# Altium project PCB_Project1.PrjPCB
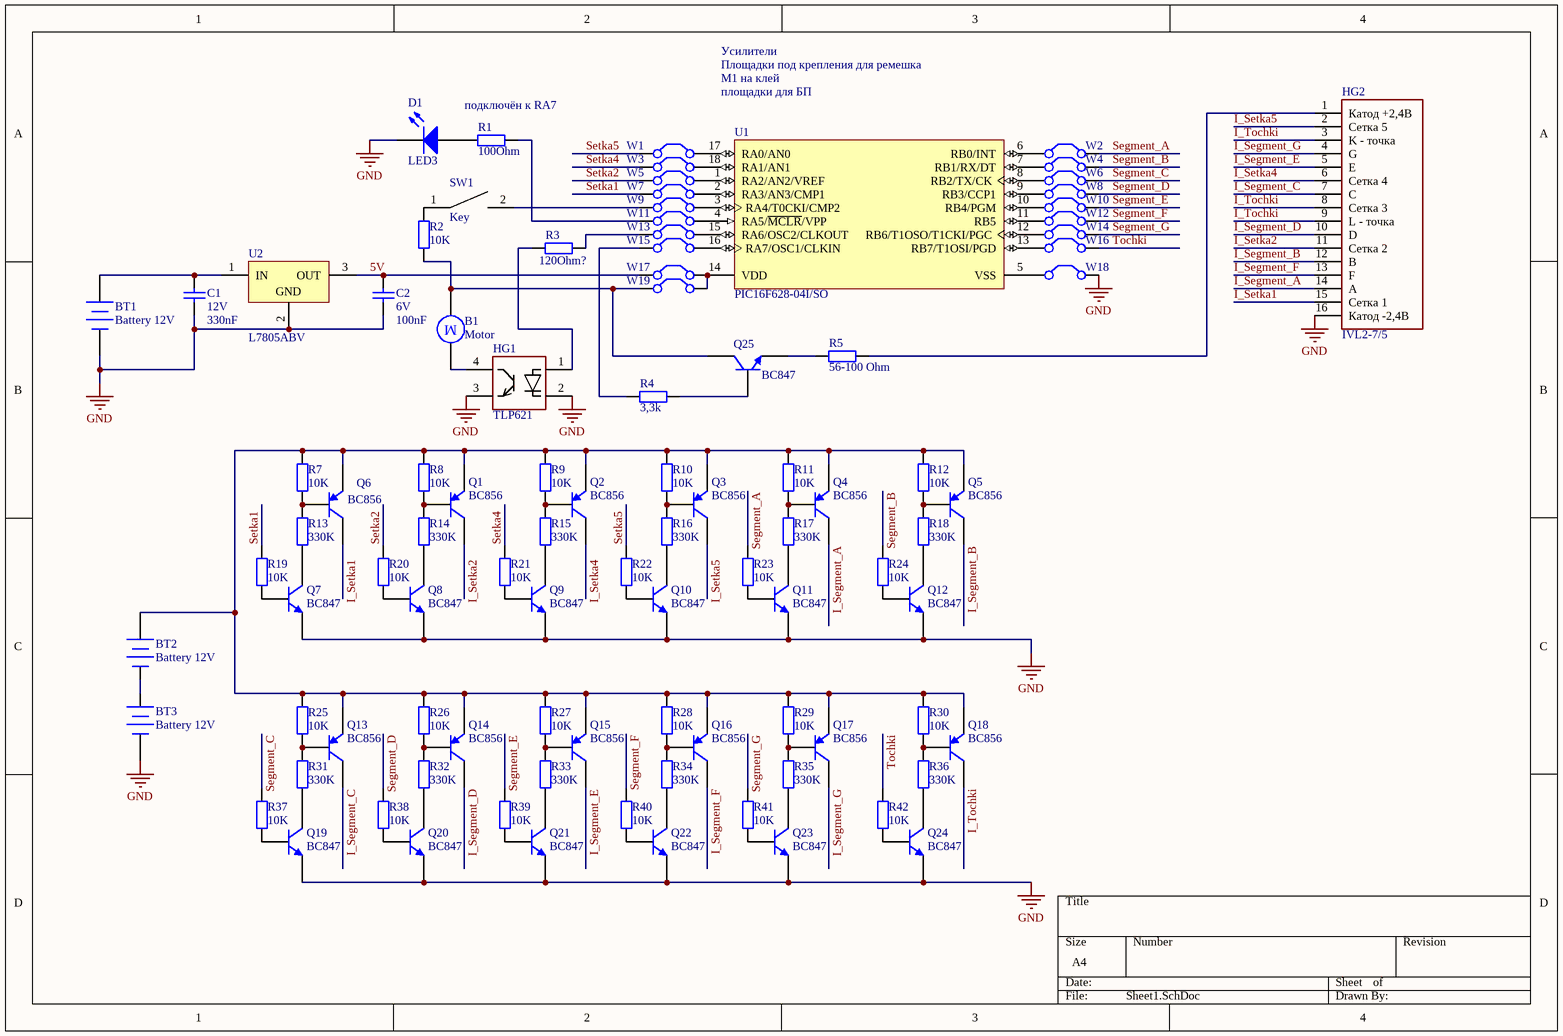
[diagram p0: Sheet1.SchDoc]
1 sheet, 97 parts. Net scope: global (net labels, ports and power ports of the same name join across sheets).
Board file: PCB1.PcbDoc

## Sheet Sheet1.SchDoc
size A4

### Parts
B1  Motor  [Motor]
BT1  Battery 12V  [BatteryA23]
BT2  Battery 12V  [BatteryA23]
BT3  Battery 12V  [BatteryA23]
C1  12V  value 330nF  [F1206]
C2  6V  value 100nF  [F1206]
D1  LED3  [F1206]
HG1  TLP621  [Photocoupler]
HG2  IVL2-7/5  [-IVL2-7/5]
Q1  BC856  [SOT23_L]
Q2  BC856  [SOT23_L]
Q3  BC856  [SOT23_L]
Q4  BC856  [SOT23_L]
Q5  BC856  [SOT23_L]
Q6  BC856  [SOT23_L]
Q7  BC847  [SOT23_N]
Q8  BC847  [SOT23_N]
Q9  BC847  [SOT23_N]
Q10  BC847  [SOT23_N]
Q11  BC847  [SOT23_N]
Q12  BC847  [SOT23_N]
Q13  BC856  [SOT23_L]
Q14  BC856  [SOT23_L]
Q15  BC856  [SOT23_L]
Q16  BC856  [SOT23_L]
Q17  BC856  [SOT23_L]
Q18  BC856  [SOT23_L]
Q19  BC847  [SOT23_N]
Q20  BC847  [SOT23_N]
Q21  BC847  [SOT23_N]
Q22  BC847  [SOT23_N]
Q23  BC847  [SOT23_N]
Q24  BC847  [SOT23_N]
Q25  BC847  [SOT23_N]
R1  value 100Ohm  [F1206]  (hidden comment: Res2)
R2  value 10K  [F1206]  (hidden comment: Res2)
R3  value 120Ohm?  [F1206]  (hidden comment: Res2)
R4  value 3,3k  [F1206]  (hidden comment: Res2)
R5  value 56-100 Ohm  [F1206]  (hidden comment: Res2)
R7  value 10K  [F0805]  (hidden comment: Res2)
R8  value 10K  [F0805]  (hidden comment: Res2)
R9  value 10K  [F0805]  (hidden comment: Res2)
R10  value 10K  [F0805]  (hidden comment: Res2)
R11  value 10K  [F0805]  (hidden comment: Res2)
R12  value 10K  [F0805]  (hidden comment: Res2)
R13  value 330K  [F1206]  (hidden comment: Res2)
R14  value 330K  [F1206]  (hidden comment: Res2)
R15  value 330K  [F1206]  (hidden comment: Res2)
R16  value 330K  [F1206]  (hidden comment: Res2)
R17  value 330K  [F1206]  (hidden comment: Res2)
R18  value 330K  [F1206]  (hidden comment: Res2)
R19  value 10K  [F1206]  (hidden comment: Res2)
R20  value 10K  [F1206]  (hidden comment: Res2)
R21  value 10K  [F1206]  (hidden comment: Res2)
R22  value 10K  [F1206]  (hidden comment: Res2)
R23  value 10K  [F1206]  (hidden comment: Res2)
R24  value 10K  [F1206]  (hidden comment: Res2)
R25  value 10K  [F0805]  (hidden comment: Res2)
R26  value 10K  [F0805]  (hidden comment: Res2)
R27  value 10K  [F0805]  (hidden comment: Res2)
R28  value 10K  [F0805]  (hidden comment: Res2)
R29  value 10K  [F0805]  (hidden comment: Res2)
R30  value 10K  [F0805]  (hidden comment: Res2)
R31  value 330K  [F1206]  (hidden comment: Res2)
R32  value 330K  [F1206]  (hidden comment: Res2)
R33  value 330K  [F1206]  (hidden comment: Res2)
R34  value 330K  [F1206]  (hidden comment: Res2)
R35  value 330K  [F1206]  (hidden comment: Res2)
R36  value 330K  [F1206]  (hidden comment: Res2)
R37  value 10K  [F1206]  (hidden comment: Res2)
R38  value 10K  [F1206]  (hidden comment: Res2)
R39  value 10K  [F1206]  (hidden comment: Res2)
R40  value 10K  [F1206]  (hidden comment: Res2)
R41  value 10K  [F1206]  (hidden comment: Res2)
R42  value 10K  [F1206]  (hidden comment: Res2)
SW1  Key  [Button]
U1  PIC16F628-04I/SO  [MCHP-SOIC-SO18_N]
U2  L7805ABV  [KREN]
W1  Jumper  [перемычка]  (value not drawn)
W2  Jumper  [перемычка]  (value not drawn)
W3  Jumper  [перемычка]  (value not drawn)
W4  Jumper  [перемычка]  (value not drawn)
W5  Jumper  [перемычка]  (value not drawn)
W6  Jumper  [перемычка]  (value not drawn)
W7  Jumper  [перемычка]  (value not drawn)
W8  Jumper  [перемычка]  (value not drawn)
W9  Jumper  [перемычка]  (value not drawn)
W10  Jumper  [перемычка]  (value not drawn)
W11  Jumper  [перемычка]  (value not drawn)
W12  Jumper  [перемычка]  (value not drawn)
W13  Jumper  [перемычка]  (value not drawn)
W14  Jumper  [перемычка]  (value not drawn)
W15  Jumper  [перемычка]  (value not drawn)
W16  Jumper  [перемычка]  (value not drawn)
W17  Jumper  [перемычка]  (value not drawn)
W18  Jumper  [перемычка]  (value not drawn)
W19  Jumper  [перемычка]  (value not drawn)

### Nets
GND: BT1.2(-) BT3.2(-) C1.1 C2.2 D1.2(K) HG1.2 HG1.3 HG2.16(Катод_-2,4В) Q7.2(E) Q8.2(E) Q9.2(E) Q10.2(E) Q11.2(E) Q12.2(E) Q19.2(E) Q20.2(E) Q21.2(E) Q22.2(E) Q23.2(E) Q24.2(E) U2.2(GND) W18.2(C2)
5V: C2.1 U2.3(OUT) W17.1(C1)
I_Segment_A: HG2.14(A) Q4.3(C)
I_Segment_B: HG2.12(B) Q5.3(C)
I_Segment_C: HG2.7(C) Q13.3(C)
I_Segment_D: HG2.10(D) Q14.3(C)
I_Segment_E: HG2.5(E) Q15.3(C)
I_Segment_F: HG2.13(F) Q16.3(C)
I_Segment_G: HG2.4(G) Q17.3(C)
I_Setka1: HG2.15(Сетка_1) Q6.3(C)
I_Setka2: HG2.11(Сетка_2) Q1.3(C)
I_Setka4: HG2.6(Сетка_4) Q2.3(C)
I_Setka5: HG2.2(Сетка_5) Q3.3(C)
I_Tochki: HG2.3(K_-_точка) HG2.8(Сетка_3) HG2.9(L_-_точка) Q18.3(C)
Segment_A: R23.1 W2.2(C2)
Segment_B: R24.1 W4.2(C2)
Segment_C: R37.1 W6.2(C2)
Segment_D: R38.1 W8.2(C2)
Segment_E: R39.1 W10.2(C2)
Segment_F: R40.1 W12.2(C2)
Segment_G: R41.1 W14.2(C2)
Setka1: R19.1 W7.1(C1)
Setka2: R20.1 W5.1(C1)
Setka4: R21.1 W3.1(C1)
Setka5: R22.1 W1.1(C1)
Tochki: R42.1 W16.2(C2)
NetB1_1: B1.1 HG1.4
NetB1_2: B1.2 Q25.3(C) R2.1 W19.1(C1)
NetBT1_1: BT1.1(+) C1.2 U2.1(IN)
NetBT2_1: BT2.1(+) Q1.2(E) Q2.2(E) Q3.2(E) Q4.2(E) Q5.2(E) Q6.2(E) Q13.2(E) Q14.2(E) Q15.2(E) Q16.2(E) Q17.2(E) Q18.2(E) R7.2 R8.2 R9.2 R10.2 R11.2 R12.2 R25.2 R26.2 R27.2 R28.2 R29.2 R30.2
NetBT2_2: BT2.2(-) BT3.1(+)
NetD1_1: D1.1(A) R1.1
NetHG1_1: HG1.1 R3.1
NetHG2_1: HG2.1(Катод_+2,4В) R5.1
NetQ1_1: Q1.1(B) R8.1 R14.2
NetQ2_1: Q2.1(B) R9.1 R15.2
NetQ3_1: Q3.1(B) R10.1 R16.2
NetQ4_1: Q4.1(B) R11.1 R17.2
NetQ5_1: Q5.1(B) R12.1 R18.2
NetQ6_1: Q6.1(B) R7.1 R13.2
NetQ7_1: Q7.1(B) R19.2
NetQ7_3: Q7.3(C) R13.1
NetQ8_1: Q8.1(B) R20.2
NetQ8_3: Q8.3(C) R14.1
NetQ9_1: Q9.1(B) R21.2
NetQ9_3: Q9.3(C) R15.1
NetQ10_1: Q10.1(B) R22.2
NetQ10_3: Q10.3(C) R16.1
NetQ11_1: Q11.1(B) R23.2
NetQ11_3: Q11.3(C) R17.1
NetQ12_1: Q12.1(B) R24.2
NetQ12_3: Q12.3(C) R18.1
NetQ13_1: Q13.1(B) R25.1 R31.2
NetQ14_1: Q14.1(B) R26.1 R32.2
NetQ15_1: Q15.1(B) R27.1 R33.2
NetQ16_1: Q16.1(B) R28.1 R34.2
NetQ17_1: Q17.1(B) R29.1 R35.2
NetQ18_1: Q18.1(B) R30.1 R36.2
NetQ19_1: Q19.1(B) R37.2
NetQ19_3: Q19.3(C) R31.1
NetQ20_1: Q20.1(B) R38.2
NetQ20_3: Q20.3(C) R32.1
NetQ21_1: Q21.1(B) R39.2
NetQ21_3: Q21.3(C) R33.1
NetQ22_1: Q22.1(B) R40.2
NetQ22_3: Q22.3(C) R34.1
NetQ23_1: Q23.1(B) R41.2
NetQ23_3: Q23.3(C) R35.1
NetQ24_1: Q24.1(B) R42.2
NetQ24_3: Q24.3(C) R36.1
NetQ25_1: Q25.1(B) R4.2
NetQ25_2: Q25.2(E) R5.2
NetR1_2: R1.2 W11.1(C1)
NetR2_2: R2.2 SW1.1
NetR3_2: R3.2 W13.1(C1)
NetR4_1: R4.1 W15.1(C1)
NetSW1_2: SW1.2 W9.1(C1)
NetU1_1: U1.1(RA2/AN2/VREF) W5.2(C2)
NetU1_2: U1.2(RA3/AN3/CMP1) W7.2(C2)
NetU1_3: U1.3(RA4/T0CKI/CMP2) W9.2(C2)
NetU1_4: U1.4(RA5/~{MCLR}/VPP) W11.2(C2)
NetU1_5: U1.5(VSS) W18.1(C1)
NetU1_6: U1.6(RB0/INT) W2.1(C1)
NetU1_7: U1.7(RB1/RX/DT) W4.1(C1)
NetU1_8: U1.8(RB2/TX/CK) W6.1(C1)
NetU1_9: U1.9(RB3/CCP1) W8.1(C1)
NetU1_10: U1.10(RB4/PGM) W10.1(C1)
NetU1_11: U1.11(RB5) W12.1(C1)
NetU1_12: U1.12(RB6/T1OSO/T1CKI/PGC) W14.1(C1)
NetU1_13: U1.13(RB7/T1OSI/PGD) W16.1(C1)
NetU1_14: U1.14(VDD) W17.2(C2) W19.2(C2)
NetU1_15: U1.15(RA6/OSC2/CLKOUT) W13.2(C2)
NetU1_16: U1.16(RA7/OSC1/CLKIN) W15.2(C2)
NetU1_17: U1.17(RA0/AN0) W1.2(C2)
NetU1_18: U1.18(RA1/AN1) W3.2(C2)

### Notes on the sheet
- подключён к RA7
- Усилители
- Площадки под крепления для ремешка
- М1 на клей
- площадки для БП
- (in symbol Motor) M

### Library data of the parts
B1 = Motor: Motor, General Kind; Published: 24-Mar-1999; LatestRevisionDate: 17-Jul-2002; LatestRevisionNote: Re-released for DXP Platform.; PackageReference: RB5-10.5; Publisher: Altium Limited; PackageDescription: Capacitor (Radial); 2 Leads
BT1-BT3 = Battery: Multicell Battery; Published: 24-Mar-1999; LatestRevisionDate: 17-Jul-2002; LatestRevisionNote: Re-released for DXP Platform.; PackageReference: BAT-2; Publisher: Altium Limited; PackageDescription: Battery; 2 Leads
C1 C2 = Cap: Capacitor; Published: 8-Jun-2000; LatestRevisionDate: 17-Jul-2002; LatestRevisionNote: Re-released for DXP Platform.; PackageReference: RAD-0.3; Publisher: Altium Limited; PackageDescription: Radial Cap, Thru-Hole; 2 Leads; 0.3 in Pin Spacing
D1 = LED3: Typical BLUE SiC LED; Published: 8-Jun-2000; LatestRevisionDate: 17-Dec-2003; LatestRevisionNote: PCB Footprint replaced.; DatasheetVersion: 16-Apr-2002; PackageVersion: 16-Apr-2002; PackageReference: 3.5X2.8X1.9; Publisher: Altium Limited; PackageDescription: SM LED; 2 C-Bend Leads; Body 3.5 x 2.8 x 1.9 mm, inc leads (LxWxH typ)
HG1 = Photocoupler
Q1-Q6 Q13-Q18 = BC856: PNP General-purpose Transistor; Published: 17-Sep-2003; LatestRevisionDate: 12-Dec-2006; LatestRevisionNote: IPC-7351 Footprint Added.; DatasheetVersion: 4-Feb-2002; PackageVersion: May-1999; PackageReference: SOT23; Publisher: Altium Limited; PackageDescription: 3-Pin SOT-23 Package 0.95 mm Pitch, 2.3 mm Lead Span; ComponentLink1Description: Manufacturer Link; ComponentLink1URL: http://www.semiconductors.philips.com/; ComponentLink2Description: Datasheet; ComponentLink2URL: http://www.semiconductors.philips.com/acrobat/datasheets/BC856_BC857_BC858_6.pdf
Q7-Q12 Q19-Q25 = BC847: NPN General-purpose Transistor; Published: 17-Sep-2003; LatestRevisionDate: 12-Dec-2006; LatestRevisionNote: IPC-7351 Footprint Added.; DatasheetVersion: 4-Feb-2002; PackageVersion: May-1999; PackageReference: SOT23; Publisher: Altium Limited; PackageDescription: 3-Pin SOT-23 Package 0.95 mm Pitch, 2.3 mm Lead Span; ComponentLink1Description: Manufacturer Link; ComponentLink1URL: http://www.semiconductors.philips.com/; ComponentLink2Description: Datasheet; ComponentLink2URL: http://www.semiconductors.philips.com/acrobat/datasheets/BC846_BC847_BC848_5.pdf
R1-R5 R7-R42 = Res2: Resistor; Published: 8-Jun-2000; LatestRevisionDate: 17-Jul-2002; LatestRevisionNote: Re-released for DXP Platform.; PackageReference: AXIAL-0.4; Publisher: Altium Limited; PackageDescription: Axial Device, Thru-Hole; 2 Leads; 0.4 in Pin Spacing
SW1 = SW
U1 = PIC16F628-04I/SO: Flash-Based 8-Bit CMOS Microcontroller, 4 MHz, 16 I/O, -40 to 85 degC, 18-pin SOIC (SO18), Tube; Manufacturer: Microchip; Digital Communication: 0 -UART, 1 -A/E/USART, 0 -SPI, 0 -I2C; EEPROM Data Memory (bytes): 128; I/O Pins: 16; Max. CPU Speed MHz: 4; Memory Type: Flash; Operation Voltage Range: 3V - 5.5V; Program Memory KBytes: 3.5; Program Memory KWords: 2; RAM: 224; Timers: 2 - 8-bit, 1 - 16-bit; DatasheetVersion: Rev. C; PackageVersion: C04-051C, 12/2012; PackageReference: SOIC-SO18; PackageDescription: 18-Lead Plastic Small Outline, 7.5 x 11.55 mm Body, 1.27 mm Pitch; Supplier 1: Digi-Key; Supplier Part Number 1: PIC16F628-04I/SO-ND; Supplier 2: Newark; Supplier Part Number 2: 65K1041; Supplier 3: Mouser; Supplier Part Number 3: 579-PIC16F628-04I/SO; Packing: TUBE; RoHS: TRUE; Mounting Technology: Surface Mount; PartNumber: PIC16F628-04I/SO; ComponentLink1Description: Datasheet; ComponentLink1URL: http://ww1.microchip.com/downloads/en/DeviceDoc/40300C.pdf; ComponentLink2Description: Package Specification; ComponentLink2URL: http://www.microchip.com/stellent/groups/techpub_sg/documents/packagingspec/en012702.pdf; ComponentLink3Description: URL Link1; ComponentLink3URL: Product URL:http://www.microchip.com/datasheet/PIC16F628
U2 = L7805ABV: Positive Voltage Regulator, 5V, 3-Pin TO-220; DatasheetVersion: Nov-2011; PackageVersion: ver3.0; PackageReference: TO220; PackageDescription: TO, Thru-Hole, Vertical, Heatsink Mounted; 3 In-Line Leads; Pitch 2.54 mm; PartNumber: L7805ABV; ComponentLink1Description: Manufacturer URL; ComponentLink1URL: http://www.st.com; ComponentLink2Description: Datasheet; ComponentLink2URL: http://www.st.com/internet/com/TECHNICAL_RESOURCES/TECHNICAL_LITERATURE/DATASHEET/CD00000444.pdf; ComponentLink3Description: Package Specification; ComponentLink3URL: http://www.st.com/internet/com/TECHNICAL_RESOURCES/TECHNICAL_LITERATURE/PACKAGE_INFORMATION/CD00004649.pdf
W1-W19 = Jumper: Jumper Wire; Published: 24-Mar-1999; LatestRevisionDate: 17-Jul-2002; LatestRevisionNote: Re-released for DXP Platform.; PackageReference: RAD-0.2; Publisher: Altium Limited; PackageDescription: Radial Cap, Thru-Hole; 2 Leads; 0.2 in Pin Spacing